# Altium schematic sheet DX-LR03-V2.1_SCH_Part_AD.SchDoc
size 431 x 279 mm; SchematicName: $$$NONE
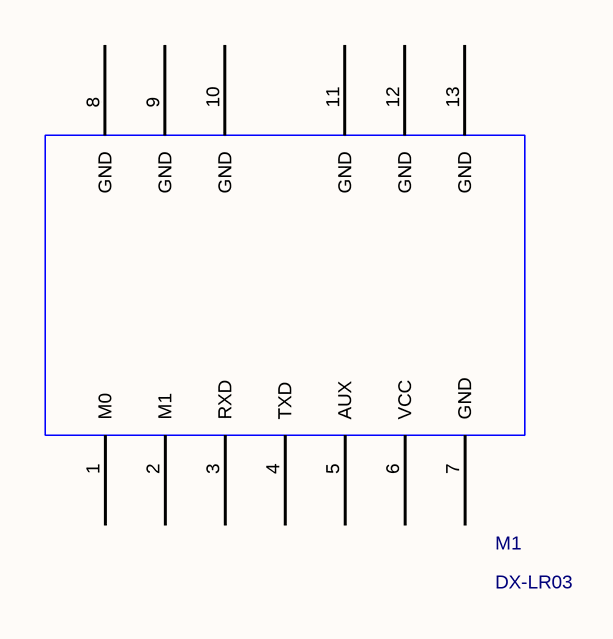
[diagram p0: DX-LR03-V2.1_SCH_Part_AD.SchDoc]

## Parts
M1  DX-LR03  [DX-LR03]

## Nets

Not connected (* = marked no-connect by the designer): M1 1(M0) 2(M1) 3(RXD) 4(TXD) 5(AUX) 6(VCC) 7(GND) 8(GND) 9(GND) 10(GND) 11(GND) 12(GND) 13(GND)

## Library data of the parts
M1 = DX-LR03: Value: DX-LR03; PCB DECAL: DX-LR03